# EAGLE design ttl (EAGLE 7.2.0)
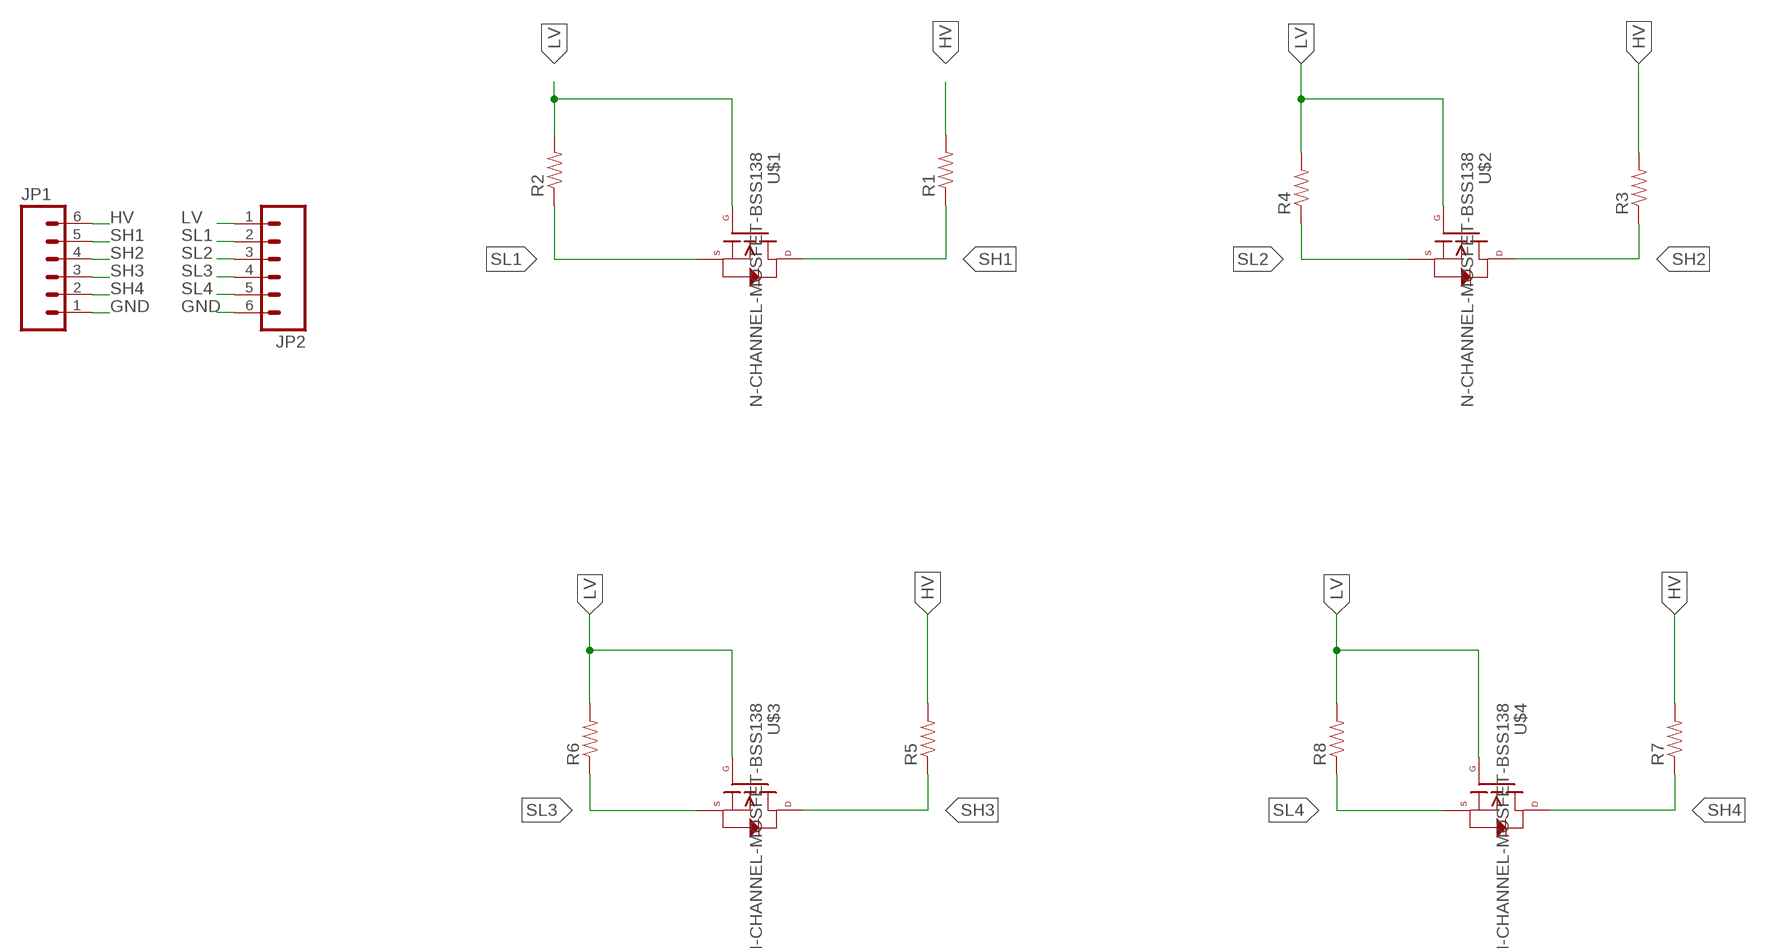
[diagram p0: schematic, sheet 1]

## Parts
JP1  M06LOCK_LONGPADS  [1X06_LOCK_LONGPADS]
JP2  M06LOCK_LONGPADS  [1X06_LOCK_LONGPADS]
R1  RESISTOR0603-RES  [0603-RES]
R2  RESISTOR0603-RES  [0603-RES]
R3  RESISTOR0603-RES  [0603-RES]
R4  RESISTOR0603-RES  [0603-RES]
R5  RESISTOR0603-RES  [0603-RES]
R6  RESISTOR0603-RES  [0603-RES]
R7  RESISTOR0603-RES  [0603-RES]
R8  RESISTOR0603-RES  [0603-RES]
U$1  N-CHANNEL-MOSFET-BSS138  [SOT23-3]
U$2  N-CHANNEL-MOSFET-BSS138  [SOT23-3]
U$3  N-CHANNEL-MOSFET-BSS138  [SOT23-3]
U$4  N-CHANNEL-MOSFET-BSS138  [SOT23-3]

## Nets
GND: JP1.1 JP2.6
HV: JP1.6 R1.2 R3.2 R5.2 R7.2
LV: JP2.1 R2.2 R4.2 R6.2 R8.2 U$1.1(G) U$2.1(G) U$3.1(G) U$4.1(G)
SH1: JP1.5 R1.1 U$1.3(D)
SH2: JP1.4 R3.1 U$2.3(D)
SH3: JP1.3 R5.1 U$3.3(D)
SH4: JP1.2 R7.1 U$4.3(D)
SL1: JP2.2 R2.1 U$1.2(S)
SL2: JP2.3 R4.1 U$2.2(S)
SL3: JP2.4 R6.1 U$3.2(S)
SL4: JP2.5 R8.1 U$4.2(S)

## Library data of the parts
JP1 JP2 = SparkFun-Connectors:M06: Header 6 Standard 6-pin 0.1" header. Use with straight break away headers (SKU : PRT-00116), right angle break away headers (PRT-00553), swiss pins (PRT-00743), machine pins (PRT-00117), and female headers (PRT-00115). Molex polarized connector foot print use with SKU : PRT-08094 with associated crimp pins and housings. NOTES ON THE VARIANTS LOCK and LOCK_LONGPADS... This footprint was designed to help hold the alignment of a through-hole component (i.e. 6-pin header) while soldering it into place. You may notice that each hole has been shifted either up or down by 0.005 of an inch from it's more standard position (which is a perfectly straight line). This slight alteration caused the pins (the squares in the middle) to touch the edges of the holes. Because they are alternating, it causes a "brace" to hold the component in place. 0.005 has proven to be the perfect amount of "off-center" position when using our standard breakaway headers. Although looks a little odd when you look at the bare footprint, once you have a header in there, the alteration is very hard to notice. Also,if you push a header all the way into place, it is covered up entirely on the bottom side. This idea of altering the position of holes to aid alignment will be further integrated into the Sparkfun Library for other footprints. It can help hold any component with 3 or more connection pins.
R1-R8 = SparkFun-Passives:RESISTOR: Resistor Basic schematic elements and footprints for 0603, 1206, and PTH resistors.
U$1-U$4 = GeekAmmo:N-CHANNEL-MOSFET: N-Channel MOSFET Mode Field Effect Transistor; DATASHEET: http://www.fairchildsemi.com/ds/BS/BSS138.pdf; DIGIKEY: BSS138TR-ND; ELEMENT14: 2323154; URL: http://au.element14.com/fairchild-semiconductor/bss138/mosfet-n-ch-50v-220ma-sot-23/dp/2323154

## Board
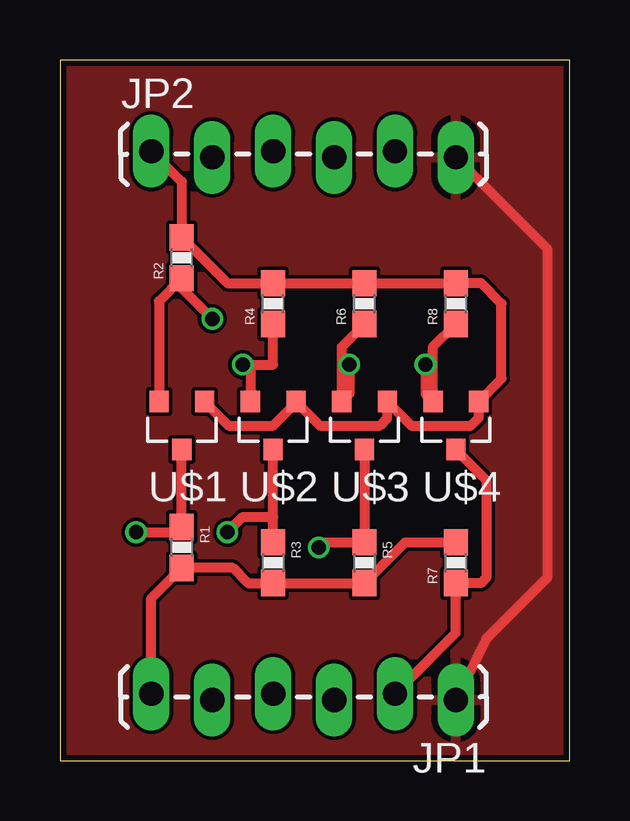
[diagram p1: board, top side]
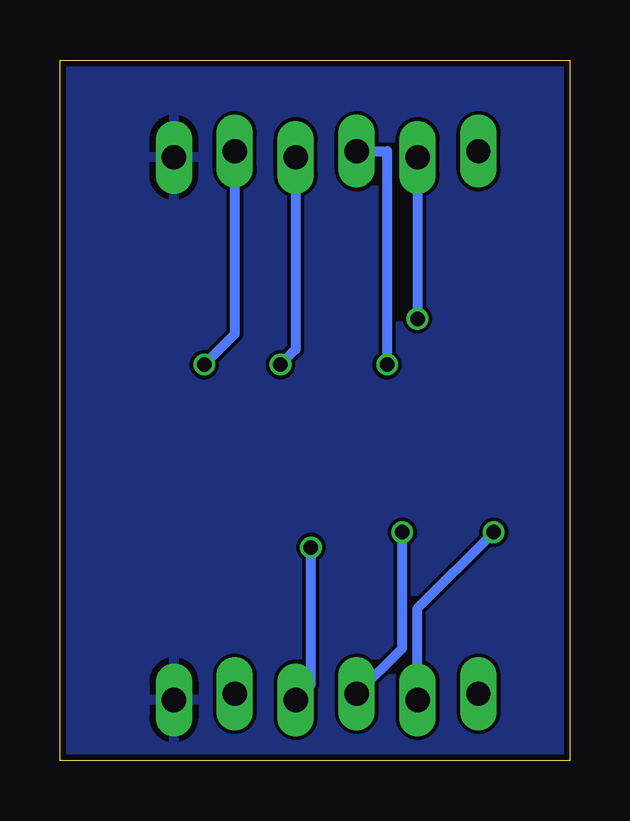
[diagram p2: board, bottom side, seen from below]

Size 21.26 x 29.2 mm. Coordinates in mm from the lower left corner, seen from the top.
Outline: 0,0 21.26,0 21.26,29.2 0,29.2 0,0
Copper layers (1*16): Top 0.035mm / dielectric 1.5mm / Bottom 0.035mm
Design rules "SeeedStudio_2layer_DRU_no_angle_20140221": minimum track width 6mil, minimum drill 12mil, track to track 6mil, track to pad 6mil, pad to pad 6mil, via to via 6mil, smd to smd 0mil, copper to edge 10mil, drill to drill 10mil, minimum pad ring 10mil, minimum via ring 6mil, stop-mask expansion 2mil, vias tented up to drill 100mil, thermal gap 10mil

### Footprints (pad centres in the part's own frame; a part is rotated, then mirrored left to right if it is on the bottom)
1X06_LOCK_LONGPADS = drill 1.016 long: 1 0,0; 2 2.54,-0.254; 3 5.08,0; 4 7.62,-0.254; 5 10.16,0; 6 12.7,-0.254
0603-RES = smd 1.1 x 1: 1 -0.85,0; 2 0.85,0
SOT23-3 = smd 0.8 x 0.9: 1 -0.95,-1; 2 0.95,-1; 3 0,1

### Placement (x,y rotation side)
JP1  16.51,2.54 180 top
JP2  3.81,25.4 0 top
R1  5.08,8.89 270 top
R2  5.08,20.95 90 top
R3  8.89,8.26 270 top
R4  8.89,19.05 90 top
R5  12.7,8.26 270 top
R6  12.7,19.05 90 top
R7  16.51,8.26 90 top
R8  16.51,19.05 90 top
U$1  5.08,13.97 180 top
U$2  8.89,13.97 180 top
U$3  12.7,13.97 180 top
U$4  16.51,13.97 180 top

### Tracks (layer width: path | path; a pad name or v marks a point on that pad's centre or on a via)
GND
  Top 0.406: JP2.6 20.32,21.34 20.32,7.62 17.78,5.08 JP1.1
  pour Top: -2.54,30.48 22.86,30.48 22.86,-2.54 -2.54,-2.54
  pour Bottom: -2.54,30.48 22.86,30.48 22.86,-2.54 -2.54,-2.54
HV
  Top 0.406: R7.2 14.4,9.11 R5.2 R3.2 7.84,7.41 7.21,8.04 R1.2 3.81,6.77 JP1.6
LV
  Top 0.406: JP2.1 5.08,24.13 R2.2 6.99,19.9 R4.2 R6.2 R8.2 17.57,19.9 18.41,19.05 18.41,15.93 U$4.1 17.46,14.29 17.14,13.97 14.65,13.97 U$3.1 13.65,14.29 13.34,13.97 10.84,13.97 U$2.1 9.84,14.92 8.89,13.97 7.03,13.97 U$1.1
SH1  (via drill 0.6)
  Top 0.406: U$1.3 R1.1 4.87,9.53 v3.17,9.53
  Bottom 0.406: JP1.5 6.35,6.35 v3.17,9.53
SH2  (via drill 0.6)
  Top 0.406: R3.1 8.89,10.16 | 8.89,10.16 U$2.3 | v6.99,9.53 7.62,10.16 8.89,10.16
  Bottom 0.406: JP1.4 6.99,4.7 v6.99,9.53
SH3  (via drill 0.6)
  Top 0.406: U$3.3 R5.1 11.01,9.11 v10.8,8.89
  Bottom 0.406: JP1.3 10.8,3.17 v10.8,8.89
SH4
  Top 0.406: U$4.3 17.78,11.7 17.78,7.62 17.57,7.41 R7.1 16.51,5.33 JP1.2
SL1  (via drill 0.6)
  Top 0.406: U$1.2 4.13,19.16 R2.1 5.08,19.68 v6.35,18.41
  Bottom 0.406: JP2.2 v6.35,18.41
SL2  (via drill 0.6)
  Top 0.406: v7.62,16.51 7.94,16.51 | 7.94,16.51 U$2.2 | 7.94,16.51 8.89,16.51 R4.1
  Bottom 0.406: JP2.3 7.62,25.4 v7.62,16.51
SL3  (via drill 0.6)
  Top 0.406: v12.07,16.51 12.07,15.29 U$3.2 11.75,17.25 R6.1
  Bottom 0.406: JP2.4 11.43,17.14 v12.07,16.51
SL4  (via drill 0.6)
  Top 0.406: v15.24,16.51 15.24,15.29 U$4.2 15.56,17.25 R8.1
  Bottom 0.406: JP2.5 13.97,17.78 v15.24,16.51